# Altium schematic sheet SimCard.SchDoc: Sim Card
size A4; DrawnBy: Muhammet YILDIZ; Organization: YıLDıZ IoT; Revision: 1.1; SheetNumber: 7; SheetTotal: 7; SheetSize: A4
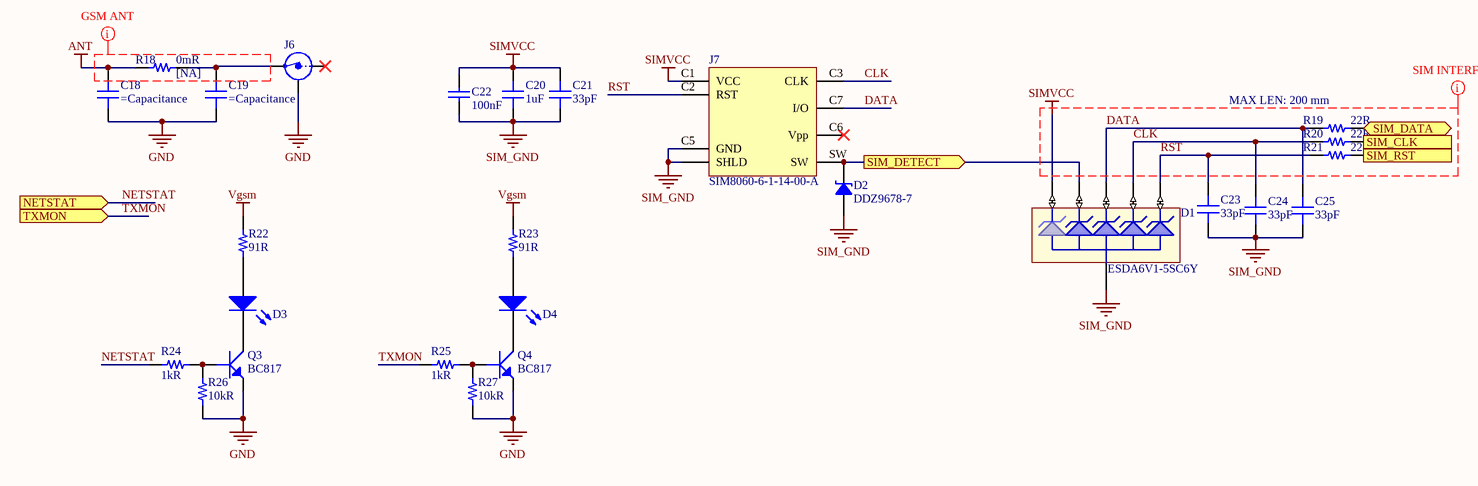
[diagram p0: SimCard.SchDoc]

## Parts
C18  (no value)  [CAP 0603/1608]  (no BOM)
C19  (no value)  [CAP 0603/1608]  (no BOM)
C20  1uF  [CAP 0603/1608]
C21  33pF  [CAP 0603/1608]
C22  100nF  [CAP 0603/1608]
C23  33pF  [CAP 0603/1608]
C24  33pF  [CAP 0603/1608]
C25  33pF  [CAP 0603/1608]
D1  ESDA6V1-5SC6Y  [SOT23-6]
D2  DDZ9678-7  [SOD-123]
D3  150080VS75000  [LED-0805-A]  (value not drawn)  (no BOM)
D4  150080VS75000  [LED-0805-A]  (value not drawn)  (no BOM)
J6  1909763-1  [TE C-1909763]  (value not drawn)
J7  SIM8060-6-1-14-00-A  [GCT SIM8060-6-1-14-00-A]
Q3  BC817  [SOT23-3]  (no BOM)
Q4  BC817  [SOT23-3]  (no BOM)
R18  0mR  [RES 0603/1608]  (no BOM)
R19  22R  [RES 0603/1608]
R20  22R  [RES 0603/1608]
R21  22R  [RES 0603/1608]
R22  91R  [RES 0603/1608]  (no BOM)
R23  91R  [RES 0603/1608]  (no BOM)
R24  1kR  [RES 0603/1608]
R25  1kR  [RES 0603/1608]
R26  10kR  [RES 0603/1608]
R27  10kR  [RES 0603/1608]

## Ports
NETSTAT (in), SIM_CLK (in), SIM_DATA (bidir), SIM_DETECT (out), SIM_RST (in), TXMON (in)

## Nets
ANT: C18.2 R18.1
GND: C18.1 C19.1 J6.G(Shield) Q3.2(E) Q4.2(E) R26.1 R27.1
SIM_GND: C20.1 C21.1 C22.1 C23.1 C24.1 C25.1 D1.2 D2.1 J7.C5(GND) J7.S(SHLD)
SIMVCC: C20.2 C21.2 C22.2 D1.1 J7.C1(VCC)
Vgsm: R22.2 R23.2
CLK: C24.2 D1.5 J7.C3(CLK) R20.1
DATA: C25.2 D1.4 J7.C7(I/O) R19.1
NETSTAT: R24.2 ; port NETSTAT
RST: C23.2 D1.6 J7.C2(RST) R21.1
SIM_CLK: R20.2 ; port SIM_CLK
SIM_DATA: R19.2 ; port SIM_DATA
SIM_DETECT: D1.3 D2.2 J7.SW ; port SIM_DETECT
SIM_RST: R21.2 ; port SIM_RST
TXMON: R25.2 ; port TXMON
NetC19_2: C19.2 J6.S(IN) R18.2
NetD3_A: D3.A R22.1
NetD3_K: D3.K Q3.3(C)
NetD4_A: D4.A R23.1
NetD4_K: D4.K Q4.3(C)
NetQ3_1: Q3.1(B) R24.1 R26.2
NetQ4_1: Q4.1(B) R25.1 R27.2

Not connected (* = marked no-connect by the designer): J7 C6(Vpp)*

## Layout directives
net class SIM CARD: CLK, DATA, RST, SIMVCC
net class GSM ANT: (no net found under the mark)

## Notes on the sheet
- MAX LEN: 200 mm
- Title:
- Size:
- Project:
- Revision:
- Sheet
- of
- Date:
- YıLDıZ IoT
- Elperek Mahallesi
- Saray Sokak, No:12
- SAKARYA / TURKEY
- File:

## Library data of the parts
C18 C19 = Capacitor - Ceramic: Ceramic, SMT Capacitor
C20 = Capacitor - Ceramic: Ceramic, SMT Capacitor; Manufacturer: Samsung; Manufacturer Part Number: CL10A105KP8NNNC; Tolerance: 10%; Voltage Rating: 10V; Dielectric: X5R; Supplier 1: Digi-Key; Supplier Part Number 1: 1276-1182-1-ND; Stock 1: 4590831; Pricing 1: 1 = 0,10000, 10 = 0,03800, 100 = 0,01680, 500 = 0,01200, 1000 = 0,00943 (USD); RoHS: Yes; Mount: Surface Mount; Case/Package: 0603; Case Code (Metric): 1608; Case Code (Imperial): 0603; Contact Plating: Tin; Min Operating Temperature: -55°C; Max Operating Temperature: 85°C; Packaging: Tape and Reel; Package Quantity: 1; Capacitance: 1uF; Voltage: 10V; Length: 1.6mm; Height: 0.8mm; Width: 0.031inch; Thickness: 0.035inch; Depth: 0.8mm; Radiation Hardening: No; ComponentLink1URL: https://datasheet.ciiva.com/15195/getdatasheetpartid-358616-15195708.pdf?src-supplier=Verical; ComponentLink1Description: https://datasheet.ciiva.com/15195/getdatasheetpartid-358616-15195708.pdf?src-supplier=Verical; ComponentLink2URL: https://datasheet.ciiva.com/16358/cl05b104kq5nnnc-16358431.pdf?src-supplier=Future+Electronics; ComponentLink2Description: https://datasheet.ciiva.com/16358/cl05b104kq5nnnc-16358431.pdf?src-supplier=Future+Electronics
C21 C23-C25 = Capacitor - Ceramic: Ceramic, SMT Capacitor; Manufacturer: Walsin Technologies; Manufacturer Part Number: 0603N330J500CT; Tolerance: 5%; Dielectric: C0G; Voltage Rating: 50V; Supplier 1: Digi-Key; Supplier Part Number 1: 1292-1645-1-ND; Stock 1: 411190; Pricing 1: 1 = 0,10000, 10 = 0,03300, 100 = 0,01490, 500 = 0,01062, 1000 = 0,00835 (USD); RoHS: Yes; Case/Package: Ceramic; Case Code (Metric): 1608; Case Code (Imperial): 0603; Min Operating Temperature: -55°C; Max Operating Temperature: 125°C; Capacitance: 33pF; Packaging: Tape and Reel; Voltage Rating (DC): 50V; Length: 1.6mm; Depth: 0.8mm; Radiation Hardening: No; REACH SVHC: Unknown; Lead Free: Lead Free; ComponentLink1URL: https://www.verical.com/server-webapp/html/getDatasheet?partID=572322&src-supplier=Verical; ComponentLink1Description: https://www.verical.com/server-webapp/html/getDatasheet?partID=572322&src-supplier=Verical
C22 = Cap - Ceramic: Capacitor, Ceramic; Manufacturer: Samsung; Manufacturer Part Number: CL10A104KA8NNNC; Tolerance: 10%; Voltage Rating: 25V; Dielectric: X5R; Supplier 1: Digi-Key; Supplier Part Number 1: 1276-1857-1-ND; Stock 1: 978306; Pricing 1: 1 = 0,10000, 10 = 0,04600, 100 = 0,02070, 500 = 0,01478, 1000 = 0,01162 (USD); RoHS: Yes; Mount: Surface Mount; Case/Package: 0603; Case Code (Metric): 1608; Case Code (Imperial): 0603; Contact Plating: Tin; Min Operating Temperature: -55°C; Max Operating Temperature: 85°C; Package Quantity: 1; Packaging: Tape and Reel; Capacitance: 100nF; Voltage Rating (DC): 25V; Termination: Wraparound; Length: 0.063inch; Width: 0.031inch; Thickness: 0.035inch; Lead Free: Lead Free; ComponentLink1URL: http://www.samsungsem.com/kr/support/library/product-catalog/mlcc.jsp; ComponentLink1Description: http://www.samsungsem.com/kr/support/library/product-catalog/mlcc.jsp; Price: 0,1
D1 = TVS Array 5 ch: Dual-line Transil™,  transient voltage suppressor (TVS); Manufacturer: STMicroelectronics; Type: Zener; Voltage - Reverse Standoff (Typ): 5.2V; Voltage - Breakdown (Min): 6.1V; Voltage - Clamping (Max) @ Ipp: 11.4V; Current - Peak Pulse (10/1000µs): 7A (8/20µs); Power - Peak Pulse: 80W; Power Line Protection: No; Supplier 1: Digi-Key; RoHS: RoHS Compliant; Category: Circuit Protection; Stock 1: 55; Pricing 1: 1=0.37, 10=0.3, 100=0.2042, 500=0.15314, 1000=0.11486 (USD); Packaging: Cut Tape (CT); Part Status: Active; Applications: General Purpose; Capacitance @ Frequency: -; Operating Temperature: -40°C ~ 150°C (TJ); Mounting Type: Surface Mount; Package / Case: SOT-23-6; Supplier Device Package: SOT-23-6; ComponentLink1URL: http://www.st.com/content/ccc/resource/technical/document/datasheet/group3/cf/58/f6/44/dc/90/4f/72/DM00342426/files/DM00342426.pdf/jcr:content/translations/en.DM00342426.pdf; ComponentLink1Description: http://www.st.com/content/ccc/resource/technical/document/datasheet/group3/cf/58/f6/44/dc/90/4f/72/DM00342426/files/DM00342426.pdf/jcr:content/translations/en.DM00342426.pdf; Supplier Part Number 1: 497-17311-1-ND; Manufacturer Part Number: ESDA6V1-5SC6Y
D2 = DDZ9678-7: DIODE ZENER 1.8V 500MW SOD123; Manufacturer: Diodes Incorporated; Current - Reverse Leakage @ Vr: 7.5µA @ 1V; Tolerance: ±5%; Voltage - Forward (Vf) (Max) @ If: 900mV @ 10mA; Part Number: DDZ9678-7; ComponentLink1Description: Datasheet; ComponentLink1URL: https://www.diodes.com/assets/Datasheets/ds30410.pdf; ComponentLink2Description: DigiKey Link; ComponentLink2URL: http://digikey.com/product-detail/en/diodes-incorporated/DDZ9678-7/DDZ9678DICT-ND/1964750; LastUpdated: 02.09.2020 01:19:27; Lifecycle Status: Active; Minimum Order: 1; Mounting Type: Surface Mount; Operating Temperature: -65°C ~ 150°C; Package / Case: SOD-123; Packaging: TapeAndReel; PartId: 1698; Part Status: Active; Power - Max: 500mW; Price: 0.06; Series: -; Supplier 1: DigiKey; Supplier Part Number 1: DDZ9678DICT-ND; Supplier Device Package: SOD-123; Voltage - Zener (Nom) (Vz): 1.8V
D3 D4 = LED: Smd Led; Manufacturer: Wurth Electronics; Color: Green; Luminous Intensity: 40mcd; Forward Current: 30mA; Forward Voltage: 2V; Viewing Angle: 140°; Wavelength: 570nm; Lens Style: Clear,Rectangular; Test Current: 20mA; Supplier 1: Digi-Key; Supplier Part Number 1: 732-4986-1-ND; Manufacturer Part Number: 150080VS75000; Stock 1: 73352; Pricing 1: 1 = 0,17000, 50 = 0,16000, 100 = 0,13700, 500 = 0,11800 (USD); RoHS: Yes; Mount: Surface Mount; Case/Package: 0805; Case Code (Metric): 2012; Case Code (Imperial): 0805; Min Operating Temperature: -40°C; Max Operating Temperature: 85°C; Package Quantity: 4000; Packaging: Tape and Reel; Dominant Wavelength: 570nm; Length: 2mm; Height: 0.7mm; Width: 1.25mm; REACH SVHC: Unknown; ComponentLink1URL: http://www.farnell.com/datasheets/1911352.pdf?src-supplier=Element14; ComponentLink1Description: http://www.farnell.com/datasheets/1911352.pdf?src-supplier=Element14; ComponentLink2URL: https://katalog.we-online.de/led/datasheet/150080VS75000.pdf?src-supplier=Digi-Key; ComponentLink2Description: https://katalog.we-online.de/led/datasheet/150080VS75000.pdf?src-supplier=Digi-Key; ComponentLink3URL: http://www.produktinfo.conrad.com/datenblaetter/750000-774999/759437-da-01-en-CHIPLED_0805_W_KL_H_GRUEN_150080VS7500.pdf?src-supplier=Conrad; ComponentLink3Description: http://www.produktinfo.conrad.com/datenblaetter/750000-774999/759437-da-01-en-CHIPLED_0805_W_KL_H_GRUEN_150080VS7500.pdf?src-supplier=Conrad
J6 = RF Connector - UFL: Coaxial Connector with Switch; Manufacturer: TE Connectivity AMP; Body Material: Polymer,Liquid Crystal Polymer; Body Plating: Gold; Dielectric Material: Polymer; Connector System: Cable-to-Board; Number of Positions: 1; Frequency: 6GHz; Sealable: No (Without); Gender: Female; Impedance: 50R; Connector Type: Jack; Supplier 1: Digi-Key; Supplier Part Number 1: A118077CT-ND; Manufacturer Part Number: 1909763-1; Stock 1: 72730; Pricing 1: 1 = 0,50000, 10 = 0,47200, 100 = 0,36150, 500 = 0,31436, 1000 = 0,25935 (USD); RoHS: Yes; Mount: Panel; Case/Package: SMD/SMT; Contact Plating: Gold; Contact Material: Copper Alloy; Housing Color: Beige; Insulation Material: Thermoplastic; Min Operating Temperature: -40°C; Max Operating Temperature: 194°C; Max Frequency: 6GHz; Termination: SMD/SMT; Packaging: Tape and Reel; Package Quantity: 1; Fastening Type: Push,Pull; Orientation: Straight; Length: 3mm; Radiation Hardening: No; ELV: Compliant; Lead Free: Lead Free; ComponentLink1URL: https://datasheet.ciiva.com/16312/eng-cd-1909763-b-16312469.pdf?src-supplier=Future+Electronics; ComponentLink1Description: https://datasheet.ciiva.com/16312/eng-cd-1909763-b-16312469.pdf?src-supplier=Future+Electronics; ComponentLink2URL: https://datasheet.ciiva.com/16469/eng-cd-1909763-b-16469221.pdf?src-supplier=Avnet+Asia; ComponentLink2Description: https://datasheet.ciiva.com/16469/eng-cd-1909763-b-16469221.pdf?src-supplier=Avnet+Asia; ComponentLink3URL: https://datasheet.ciiva.com/9423/eng-cd-1909763-b-9423785.pdf?src-supplier=Avnet; ComponentLink3Description: https://datasheet.ciiva.com/9423/eng-cd-1909763-b-9423785.pdf?src-supplier=Avnet; ComponentLink4URL: https://datasheet.ciiva.com/29191/eng-cd-1909763-b1-basefilename-29191146.pdf?src-supplier=Digi-Key; ComponentLink4Description: https://datasheet.ciiva.com/29191/eng-cd-1909763-b1-basefilename-29191146.pdf?src-supplier=Digi-Key; ComponentLink5URL: https://datasheet.ciiva.com/29191/eng-cd-1909763-b1-basefilename-29191148.pdf?src-supplier=Digi-Key; ComponentLink5Description: https://datasheet.ciiva.com/29191/eng-cd-1909763-b1-basefilename-29191148.pdf?src-supplier=Digi-Key
J7 = SIM8060-6-1-14-00-A: CONN SIM NANO HINGED 6P W/SWITCH; Manufacturer: Global Connector Technology; ComponentLink1Description: Datasheet; ComponentLink1URL: https://gct.co/files/drawings/sim8060.pdf; ComponentLink2Description: DigiKey Link; ComponentLink2URL: http://digikey.com/product-detail/en/gct/SIM8060-6-1-14-00-A/2073-SIM8060-6-1-14-00-ACT-ND/10127236; Supplier 1: Digi-Key; Supplier Part Number 1: 2073-SIM8060-6-1-14-00-ACT-ND; Manufacturer Part Number: SIM8060-6-1-14-00-A; Stock 1: 0; RoHS: No
Q3 Q4 = BC817: Transistor, BC817; Manufacturer: ON Semiconductor; Manufacturer Part Number: BC817-16LT1G; Transistor Type: NPN; Vce Saturation (Max) @ Ib, Ic: 700mV @ 50mA, 500mA; Current - Collector Cutoff (Max): 100nA (ICBO); DC Current Gain (hFE) (Min) @ Ic, Vce: 100 @ 100mA, 1V; Frequency - Transition: 100MHz; Supplier 1: Digi-Key; Supplier Part Number 1: BC817-16LT1GOSCT-ND; RoHS: RoHS Compliant; Category: Discrete Semiconductor Products; Stock 1: 46603; Pricing 1: 1=0.13, 10=0.118, 100=0.0642, 500=0.0395, 1000=0.02693 (USD); Packaging: Cut Tape (CT); Part Status: Active; Operating Temperature: -65°C ~ 150°C (TJ); Mounting Type: Surface Mount; Package / Case: TO-236-3, SC-59, SOT-23-3; Supplier Device Package: SOT-23-3 (TO-236); Base Part Number: BC817; ComponentLink1URL: http://www.onsemi.com/pub/Collateral/BC817-16LT1-D.PDF; ComponentLink1Description: http://www.onsemi.com/pub/Collateral/BC817-16LT1-D.PDF; Price: 0,13
R18 = Resistor_Chip: Ceramic, SMT Capacitor; Manufacturer: Stackpole Electronics; Manufacturer Part Number: RMCF0603ZT0R00; Power Rating: 100mW; Current Rating: 1A; Working Voltage: 75V; Supplier 1: Digi-Key; Supplier Part Number 1: RMCF0603ZT0R00CT-ND; Stock 1: 2712388; Pricing 1: 1 = 0,10000, 10 = 0,01600, 25 = 0,01160, 50 = 0,00880, 100 = 0,00640, 250 = 0,00492, 500 = 0,00392, 1000 = 0,00289 (USD); RoHS: Yes; Mount: Surface Mount; Case/Package: 0603; Case Code (Metric): 1608; Case Code (Imperial): 0603; Contact Plating: Matte,Tin; Min Operating Temperature: -55°C; Max Operating Temperature: 155°C; Resistance: 0mR; Packaging: Tape and Reel; Composition: Thick Film; Number of Terminations: 2; Military Standard: Not; Max Power Dissipation: 100mW; Features: Automotive AEC-Q200; Length: 1.55mm; Height: 0.022inch; Width: 0.031inch; Depth: 0.8mm; Radiation Hardening: No; Lead Free: Lead Free; [NA]: [NA]
R19-R21 = Resistor_Chip: Ceramic, SMT Capacitor; Manufacturer: Yageo; Manufacturer Part Number: RC0603FR-0722RL; Tolerance: 1%; Voltage Rating (DC): 50V; Temperature Coefficient: 100ppm/°C; Power Rating: 100mW; Supplier 1: Digi-Key; Supplier Part Number 1: 311-22.0HRCT-ND; Stock 1: 4572399; Pricing 1: 1 = 0,10000, 10 = 0,02400, 100 = 0,00970, 1000 = 0,00437, 2500 = 0,00379 (USD); RoHS: Yes; Case/Package: 0603; Number of Pins: 2; Case Code (Metric): 1608; Case Code (Imperial): 0603; Min Operating Temperature: -55°C; Max Operating Temperature: 155°C; Resistance: 22R; Packaging: Tape and Reel; Composition: Thick Film; Voltage Rating: 50V; Package Quantity: 1; Number of Terminations: 2; Termination: SMD/SMT; Military Standard: Not; Max Power Dissipation: 100mW; Features: Moisture Resistant; Length: 1.6mm; Height: 0.022inch; Width: 0.031inch; Depth: 0.8mm; REACH SVHC: No SVHC; Lead Free: Lead Free; ComponentLink1URL: http://www.yageo.com/documents/recent/PYu-RC_Group_51_RoHS_L_10.pdf?src-supplier=Digi-Key; ComponentLink1Description: http://www.yageo.com/documents/recent/PYu-RC_Group_51_RoHS_L_10.pdf?src-supplier=Digi-Key; ComponentLink2URL: http://documents.rs-components.com/techlib://itc_doclist_GB.htm?stockno=5050369&src-supplier=RSComponents; ComponentLink2Description: http://documents.rs-components.com/techlib://itc_doclist_GB.htm?stockno=5050369&src-supplier=RSComponents; ComponentLink3URL: http://www.farnell.com/datasheets/1868787.pdf?src-supplier=Element14; ComponentLink3Description: http://www.farnell.com/datasheets/1868787.pdf?src-supplier=Element14; ComponentLink4URL: http://www.farnell.com/datasheets/443971.pdf?src-supplier=Element14; ComponentLink4Description: http://www.farnell.com/datasheets/443971.pdf?src-supplier=Element14
R22 R23 = Resistor_Chip: Ceramic, SMT Capacitor; Manufacturer: Yageo; Manufacturer Part Number: RC0603JR-0791RL; Tolerance: 5%; Voltage Rating (DC): 50V; Temperature Coefficient: 100ppm/°C; Power Rating: 100mW; Voltage Rating: 75V; Supplier 1: Digi-Key; Supplier Part Number 1: 311-91GRCT-ND; Stock 1: 320507; Pricing 1: 1 = 0,10000, 10 = 0,02000, 100 = 0,00810, 1000 = 0,00362, 2500 = 0,00314 (USD); RoHS: Yes; Case/Package: 0603; Weight: 7.1E-05oz; Case Code (Imperial): 0603; Case Code (Metric): 1608; Min Operating Temperature: -55°C; Max Operating Temperature: 155°C; Resistance: 91R; Packaging: Tape and Reel; Composition: Thick Film; Military Standard: Not; Termination: SMD/SMT; Working Voltage: 75V; Number of Terminations: 2; Length: 1.6mm; Height: 0.45mm; Depth: 0.8mm; Width: 0.8mm; Lead Free: Lead Free
R24 R25 = Resistor_Chip: Ceramic, SMT Capacitor; Manufacturer: Rohm; Manufacturer Part Number: ESR03EZPJ102; Tolerance: 5%; Temperature Coefficient: 200ppm/°C; Max Power Dissipation: 250mW; Supplier 1: Digi-Key; Supplier Part Number 1: RHM1.0KDCT-ND; Stock 1: 148117; Pricing 1: 1 = 0,10000, 10 = 0,08300, 100 = 0,03180, 1000 = 0,01398, 2500 = 0,01207 (USD); RoHS: Yes; Case/Package: 0603; Case Code (Metric): 1608; Case Code (Imperial): 0603; Min Operating Temperature: -55°C; Max Operating Temperature: 155°C; Resistance: 1kR; Package Quantity: 1; Packaging: Tape and Reel; Composition: Thick Film; Number of Terminations: 2; Features: Automotive AEC-Q200; Length: 0.063inch; Height: 0.022inch; Width: 0.031inch; Lead Free: Lead Free; ComponentLink1URL: https://datasheet.ciiva.com/2469/esr-2469603.pdf?src-supplier=Digi-Key; ComponentLink1Description: https://datasheet.ciiva.com/2469/esr-2469603.pdf?src-supplier=Digi-Key; ComponentLink2URL: https://datasheet.ciiva.com/2469/esr-2469604.pdf?src-supplier=Digi-Key; ComponentLink2Description: https://datasheet.ciiva.com/2469/esr-2469604.pdf?src-supplier=Digi-Key; ComponentLink3URL: https://datasheet.ciiva.com/2469/esr-2469605.pdf?src-supplier=Digi-Key; ComponentLink3Description: https://datasheet.ciiva.com/2469/esr-2469605.pdf?src-supplier=Digi-Key
R26 R27 = Resistor_Chip: Ceramic, SMT Capacitor; Manufacturer: Stackpole Electronics; Manufacturer Part Number: RNCP0603FTD10K0; Tolerance: 1%; Max Power Dissipation: 125mW; Temperature Coefficient: 100ppm/°C; Supplier 1: Digi-Key; Supplier Part Number 1: RNCP0603FTD10K0CT-ND; Stock 1: 183083; Pricing 1: 1 = 0,10000, 10 = 0,06700, 100 = 0,02730, 1000 = 0,01224, 2500 = 0,01063 (USD); RoHS: Yes; Mount: Surface Mount; Case/Package: 0603; Case Code (Metric): 1608; Case Code (Imperial): 0603; Contact Plating: Matte,Tin; Min Operating Temperature: -55°C; Max Operating Temperature: 155°C; Packaging: Tape and Reel; Resistance: 10kR; Composition: Thin Film; Number of Terminations: 2; Features: Anti-Sulfur,Moisture Resistant; Length: 0.059inch; Height: 0.02inch; Width: 0.031inch; Radiation Hardening: No; Lead Free: Lead Free